# Altium schematic sheet POWER.SchDoc
size A4; SheetNumber: 6; SheetTotal: 7
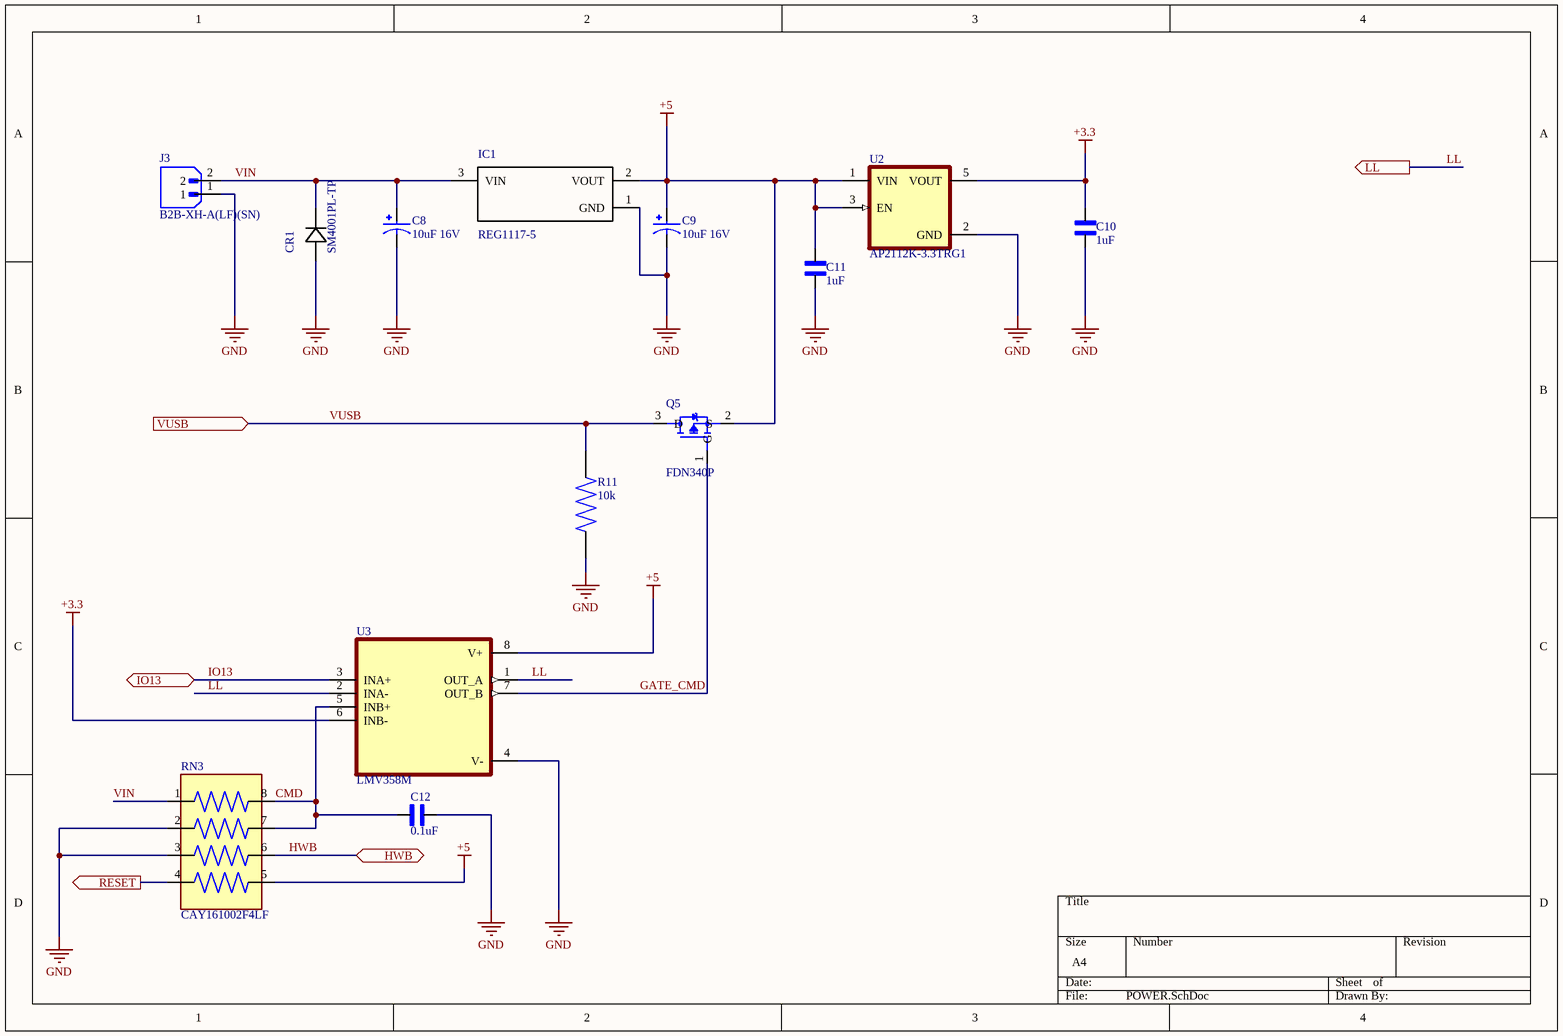
[diagram p0: POWER.SchDoc]

## Parts
C8  10uF 16V  [CAP_EEEHB1C100AR]
C9  10uF 16V  [CAP_EEEHB1C100AR]
C10  1uF  [CAPC1608X90N]
C11  1uF  [CAPC1608X90N]
C12  0.1uF  [CAPC1608X90]
CR1  SM4001PL-TP  [*SOD-123FL_MCC]
IC1  REG1117-5  [*SOT230P700X180-4N]
J3  B2B-XH-A(LF)(SN)  [JST_B2B-XH-A(LF)(SN)]
Q5  FDN340P  [SOT95P240X120-3N]
R11  10k  [RESC3115X65N]
RN3  CAY161002F4LF  [RESCAF80P320X160X60-8N]
U2  AP2112K-3.3TRG1  [SOT95P285X140-5N]
U3  LMV358M  [SOIC127P599X175-8N]

## Ports
HWB (bidir, see OVERVIEW[1B], MCU[3B]), IO13 (bidir, see OVERVIEW[1B], MCU[3B]), LL (out, see OVERVIEW[1B], MCU[1D]), RESET (out, see OVERVIEW[1B], MCU[1B]), VUSB (in, see OVERVIEW[1C], MCU[1B], USB_INT[3B])

## Nets
+3.3: C10.2 U2.5(VOUT) U3.6(INB-)
+5: C9.1 C11.1 IC1.2(VOUT) Q5.2(S) RN3.5 U2.1(VIN) U2.3(EN) U3.8(V+)
GND: C8.2 C9.2 C10.1 C11.2 C12.1 CR1.2 IC1.1(GND) J3.1 R11.1 RN3.2 RN3.3 U2.2(GND) U3.4(V-)
CMD: C12.2 RN3.7 RN3.8 U3.5(INB+)
GATE_CMD: Q5.1(G) U3.7(OUT_B)
HWB: RN3.6 ; port HWB
IO13: U3.3(INA+) ; port IO13
LL: U3.1(OUT_A) U3.2(INA-) ; port LL
RESET: RN3.4 ; port RESET
VIN: C8.1 CR1.1 IC1.3(VIN) J3.2 RN3.1
VUSB: Q5.3(D) R11.2 ; port VUSB

## Library data of the parts
C8 C9 = EEEHB1C100AR: 10ÂµF 16V Aluminum Electrolytic Capacitors Radial, Can - SMD 2000 Hrs @ 105Â°C; MP: EEE-HB1C100AR; MF: Panasonic; SnapEDA_Link: https://www.snapeda.com/parts/EEE-HB1C100AR/Panasonic/view-part/?ref=snap; Availability: In Stock; Purchase-URL: https://pricing.snapeda.com/search/part/EEE-HB1C100AR/?ref=eda; Price: None; Check_prices: https://www.snapeda.com/parts/EEE-HB1C100AR/Panasonic/view-part/?ref=eda; Value: *; Package: RADIAL-2 Panasonic
C10 C11 = C0603C105K4RAC7411: Multilayer Ceramic Capacitors MLCC / SMD/SMT Multilayer Ceramic / Capacitors MLCC  SMD/SMT 16V / 1uF X7R 0603 10%; Package: None; Price: None; Value: *; MP: C0603C105K4RAC7411; Availability: Unavailable
C12 = C0603C104J4RACTU: Capacitor;Ceramic;Cap;.0.1uF;Tol+5%;SMT;Vol-Rtg 16V;X7R;TR | KEMET C0603C104J4RACTU; SnapEDA_Link: https://www.snapeda.com/parts/C0603C104J4RACTU/KEMET/view-part/?ref=snap; Package: 603-2 KEMET; Value: *; MF: KEMET; MP: C0603C104J4RACTU; Check_prices: https://www.snapeda.com/parts/C0603C104J4RACTU/KEMET/view-part/?ref=eda
CR1 = SM4001PL-TP: Diode Standard 50 V 1A Surface Mount SOD-123FL; MF: Micro Commercial; SnapEDA_Link: https://www.snapeda.com/parts/SM4001PL-TP/Micro+Commercial+Components/view-part/?ref=snap; Package: SOD-123F MCC; MP: SM4001PL-TP; Check_prices: https://www.snapeda.com/parts/SM4001PL-TP/Micro+Commercial+Components/view-part/?ref=eda; Value: *
IC1 = REG1117-5: 800-mA, 15-V, linear voltage regulator; MF: Texas Instruments; SnapEDA_Link: https://www.snapeda.com/parts/REG1117-5/Texas+Instruments/view-part/?ref=snap; Package: SOT-223-4 Texas Instruments; MP: REG1117-5; Check_prices: https://www.snapeda.com/parts/REG1117-5/Texas+Instruments/view-part/?ref=eda; Value: *
J3 = B2B-XH-A(LF)(SN): Connector Header Through Hole 2 position 0.098 (2.50mm); MF: JST Sales; SnapEDA_Link: https://www.snapeda.com/parts/B2B-XH-A(LF)(SN)/JST/view-part/?ref=snap; Package: None; Value: *; MP: B2B-XH-A(LF)(SN); Check_prices: https://www.snapeda.com/parts/B2B-XH-A(LF)(SN)/JST/view-part/?ref=eda
Q5 = FDN340P: P-Channel 20 V 2A (Ta) 500mW (Ta) Surface Mount SOT-23-3; MF: onsemi; SnapEDA_Link: https://www.snapeda.com/parts/FDN340P/Onsemi/view-part/?ref=snap; Package: TO-236-3 ON; Value: *; MP: FDN340P; Check_prices: https://www.snapeda.com/parts/FDN340P/Onsemi/view-part/?ref=eda
R11 = CRG1206F4K7/10: Res Thick Film 1206 4.7K Ohm 1% 0.25W(1/4W) Â±100ppm/C Pad SMD T/R; Power_Rating: .25 W; MF: TE Connectivity; Voltage_Rating: 200 V; SnapEDA_Link: https://www.snapeda.com/parts/CRG1206F4K7/10/TE+Connectivity/view-part/?ref=snap; Package: 1206; Resistance: 4.7K; Value: *; MP: CRG1206F4K7/10; EU_RoHS_Compliance: Compliant with Exemptions; Tolerance: 1%; Check_prices: https://www.snapeda.com/parts/CRG1206F4K7/10/TE+Connectivity/view-part/?ref=eda
RN3 = CAY161002F4LF: 10k Ohm Â±1% 62.5mW Power Per Element Isolated 4 Resistor Network/Array Â±200ppm/Â°C 1206 (3216 Metric), Convex, Long Side Terminals; MF: Bourns Electronics; SnapEDA_Link: https://www.snapeda.com/parts/CAY161002F4LF/Bourns/view-part/?ref=snap; Package: NON STANDARD-8 Bourns; Value: *; MP: CAY161002F4LF; Check_prices: https://www.snapeda.com/parts/CAY161002F4LF/Bourns/view-part/?ref=eda
U2 = AP2112K-3.3TRG1: Linear Voltage Regulator IC Positive Fixed 1 Output 600mA SOT-25; MF: Diodes Inc.; Value: *; Purchase-URL: https://pricing.snapeda.com/search/part/AP2112K-3.3TRG1/?ref=eda; Package: SOT-753 Diodes Inc.; Availability: In Stock; Check_prices: https://www.snapeda.com/parts/AP2112K-3.3TRG1/Diodes+Inc./view-part/?ref=eda; Price: None; SnapEDA_Link: https://www.snapeda.com/parts/AP2112K-3.3TRG1/Diodes+Inc./view-part/?ref=snap; MP: AP2112K-3.3TRG1
U3 = LMV358M: Dual, 5.5-V, 1-MHz op amp; MF: Texas Instruments; MP: LMV358M/NOPB; SnapEDA_Link: https://www.snapeda.com/parts/LMV358M/NOPB/Texas+Instruments/view-part/?ref=snap; Package: SOIC-8 Texas Instruments; Value: *; Check_prices: https://www.snapeda.com/parts/LMV358M/NOPB/Texas+Instruments/view-part/?ref=eda